# Altium schematic sheet Accelerometer_3Axis-bak.SchDoc
size B
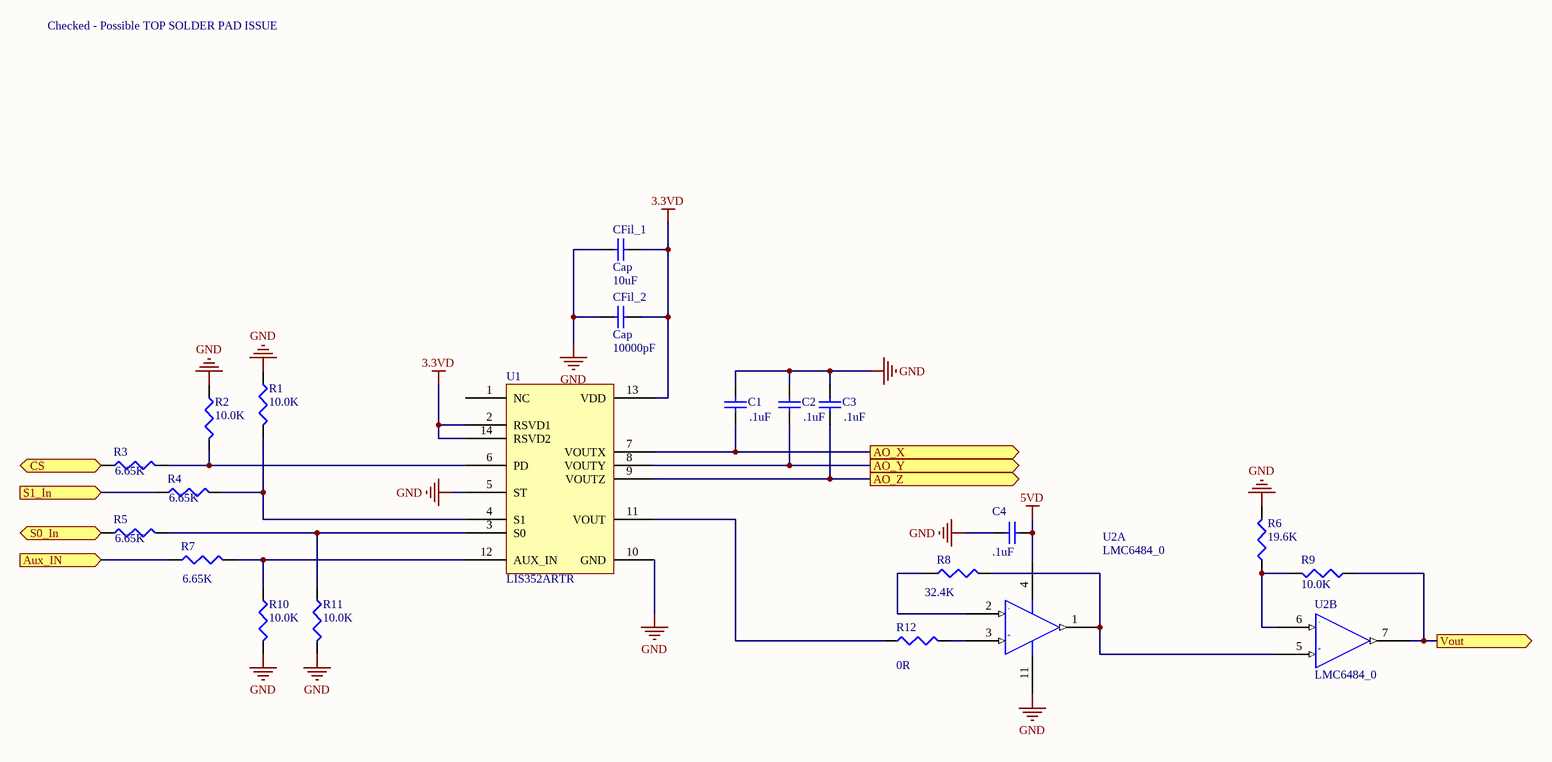
[diagram p0: Accelerometer_3Axis-bak.SchDoc]

## Parts
C1  value .1uF  [CAPC2012X09M]  (hidden comment: Cap)
C2  value .1uF  [CAPC2012X09M]  (hidden comment: Cap)
C3  value .1uF  [CAPC2012X09M]  (hidden comment: Cap)
C4  value .1uF  [CAPC2012X09M]  (hidden comment: Cap)
CFil_1  Cap  value 10uF  [CAPC2012X09M]
CFil_2  Cap  value 10000pF  [CAPC2012X09M]
R1  value 10.0K  [RESC2112X05M]  (hidden comment: Res3)
R2  value 10.0K  [RESC2112X05M]  (hidden comment: Res3)
R3  value 6.65K  [RESC2112X05M]  (hidden comment: Res3)
R4  value 6.65K  [RESC2112X05M]  (hidden comment: Res3)
R5  value 6.65K  [RESC2112X05M]  (hidden comment: Res3)
R6  value 19.6K  [RESC2112X05M]  (hidden comment: Res3)
R7  value 6.65K  [RESC2112X05M]  (hidden comment: Res3)
R8  value 32.4K  [RESC2112X05M]  (hidden comment: Res3)
R9  value 10.0K  [RESC2112X05M]  (hidden comment: Res3)
R10  value 10.0K  [RESC2112X05M]  (hidden comment: Res3)
R11  value 10.0K  [RESC2112X05M]  (hidden comment: Res3)
R12  value 0R  [RESC2112X05M]  (hidden comment: Res3)
U1  LIS352ARTR  [LGA-14-3X5MM]
U2  LMC6484_0  [SOIC127P600X175-14M-NS]  (parts A,B of 4)

## Ports
AO_X (out), AO_Y (out), AO_Z (out), Aux_IN (in), CS (in), S0_In (in), S1_In (in), Vout (out)

## Nets
3.3VD: CFil_1.1 CFil_2.1 U1.2(RSVD1) U1.13(VDD) U1.14(RSVD2)
5VD: C4.2 U2.4(VCC)
GND: C1.2 C2.2 C3.2 C4.1 CFil_1.2 CFil_2.2 R1.1 R2.1 R6.2 R10.2 R11.2 U1.5(ST) U1.10(GND) U2.11(-VCC)
AO_X: C1.1 U1.7(VOUTX) ; port AO_X
AO_Y: C2.1 U1.8(VOUTY) ; port AO_Y
AO_Z: C3.1 U1.9(VOUTZ) ; port AO_Z
Aux_IN: R7.1 ; port Aux_IN
CS: R3.1 ; port CS
S0_In: R5.1 ; port S0_In
S1_In: R4.1 ; port S1_In
Vout: R9.1 U2.7(OUT2) ; port Vout
NetR1_2: R1.2 R4.2 U1.4(S1)
NetR2_2: R2.2 R3.2 U1.6(PD)
NetR5_2: R5.2 R11.1 U1.3(S0)
NetR6_1: R6.1 R9.2 U2.6(INVIN2)
NetR7_2: R7.2 R10.1 U1.12(AUX_IN)
NetR8_1: R8.1 U2.2(INVIN_1)
NetR8_2: R8.2 U2.1(OUT1) U2.5(NINVIN2)
NetR12_1: R12.1 U1.11(VOUT)
NetR12_2: R12.2 U2.3(NINVIN_1)

Not connected (* = marked no-connect by the designer): U1 1(NC)

## Notes on the sheet
- Checked - Possible TOP SOLDER PAD ISSUE
- ESE
- is the sole property of ESE. Any reproduction
- The Information Contained in this drawing
- Schematic P/N and Name
- Sheet Name
- 299 Doon Valley Drive
- Kitchener, ON N2G 4M4
- Canada
- Approved
- in part or in whole without the written
- permission of ESE is strictly prohibited.
- APPROVALS
- DATE
- Size
- Scale
- B
- NTS
- Bare PCB P/N
- Date
- Sheet
- Rev.
- Checked
- Engineer
- of
- (in symbol LMC6484_0, part A) -; +
- (in symbol LMC6484_0, part B) -; +

## Library data of the parts
C1-C3 = CAP-Y5V-.1uF-50V-+80%/-20%: CAP CER .1uF 50v Y5V 0805; MPN: C0805C104Z5VACTU; WV: 50; PN: 399-1177-1-ND; Name: CAP-Y5V-.1uF-50V-+80%/-20%; Tolerance: +80%/-20%; Type: Y5V; URL: http://www.digikey.ca/product-detail/en/C0805C104Z5VACTU/399-1177-1-ND
C4 = CAP-X7R-.1uF-50V-±20%: CAP CER .1uF 50v X7R 0805; MPN: C0805C104M5RACTU; PN: 399-1169-1-ND; Name: CAP-X7R-.1uF-50V-±20%; URL: http://www.digikey.ca/product-detail/en/C0805C104M5RACTU/399-1169-1-ND
CFil_1 = CAP-X5R-10uF-6.3V-±10%: CAP CER 10uF 6.3v X5R 0805; MPN: C0805C106K9PACTU; PN: 399-3138-1-ND; Name: CAP-X5R-10uF-6.3V-±10%; URL: http://www.digikey.ca/product-detail/en/C0805C106K9PACTU/399-3138-1-ND
CFil_2 = CAP-Z5U-10000pF-50V-±20%: CAP CER 10000pF 50v Z5U 0805; MPN: C0805C103M5UACTU; PN: 399-1174-1-ND; Name: CAP-Z5U-10000pF-50V-±20%; URL: http://www.digikey.ca/product-detail/en/C0805C103M5UACTU/399-1174-1-ND
R1 R2 R9-R11 = Resistor_10.0K: RES SMD 10.0K OHM 1% 1/8W 0805; MPN: CRCW080510K0FKEA; PN: 541-1000KCCT-ND; Name: Resistor_10.0K; URL: http://www.digikey.ca/product-detail/en/CRCW080510K0FKEA/541-1000KCCT-ND
R3-R5 R7 = Resistor_6.65K: RES SMD 6.65K OHM 1% 1/8W 0805; MPN: CRCW08056K65FKEA; PN: 541-6.65KCCT-ND; Name: Resistor_6.65K; URL: http://www.digikey.ca/product-detail/en/CRCW08056K65FKEA/541-6.65KCCT-ND
R6 = Resistor_19.6K: RES SMD 19.6K OHM 1% 1/8W 0805; MPN: CRCW080519K6FKEA; PN: 541-19.6KCCT-ND; Name: Resistor_19.6K; URL: http://www.digikey.ca/product-detail/en/CRCW080519K6FKEA/541-19.6KCCT-ND
R8 = Resistor_32.4K: RES SMD 32.4K OHM 1% 1/8W 0805; MPN: CRCW080532K4FKEA; PN: 541-32.4KCCT-ND; Name: Resistor_32.4K; URL: http://www.digikey.ca/product-detail/en/CRCW080532K4FKEA/541-32.4KCCT-ND
R12 = Resistor_0R_Jumper: RES SMD 0 OHM 5% 1/8W 0805; MPN: CRCW08050000Z0EA; PN: 541-0.0ACT-ND; Name: Resistor_0R_Jumper; URL: http://www.digikey.ca/product-detail/en/CRCW08050000Z0EA/541-0.0ACT-ND
U1 = LIS352AR: IC ACCELEROMETER 3AXIS LP 14LGA; PN: 497-11075-1-ND; MPN: LIS352ARTR; URL: http://www.digikey.ca/product-detail/en/LIS352ARTR/497-11075-1-ND
U2 = LMC6484_0: IC OPAMP GP 1.5MHZ RRO 14SOIC; MPN: LMC6484IMX/NOPB; PN: LMC6484IMX/NOPBCT-ND; URL: http://www.digikey.ca/product-detail/en/LMC6484IMX%2FNOPB/LMC6484IMX%2FNOPBCT-ND